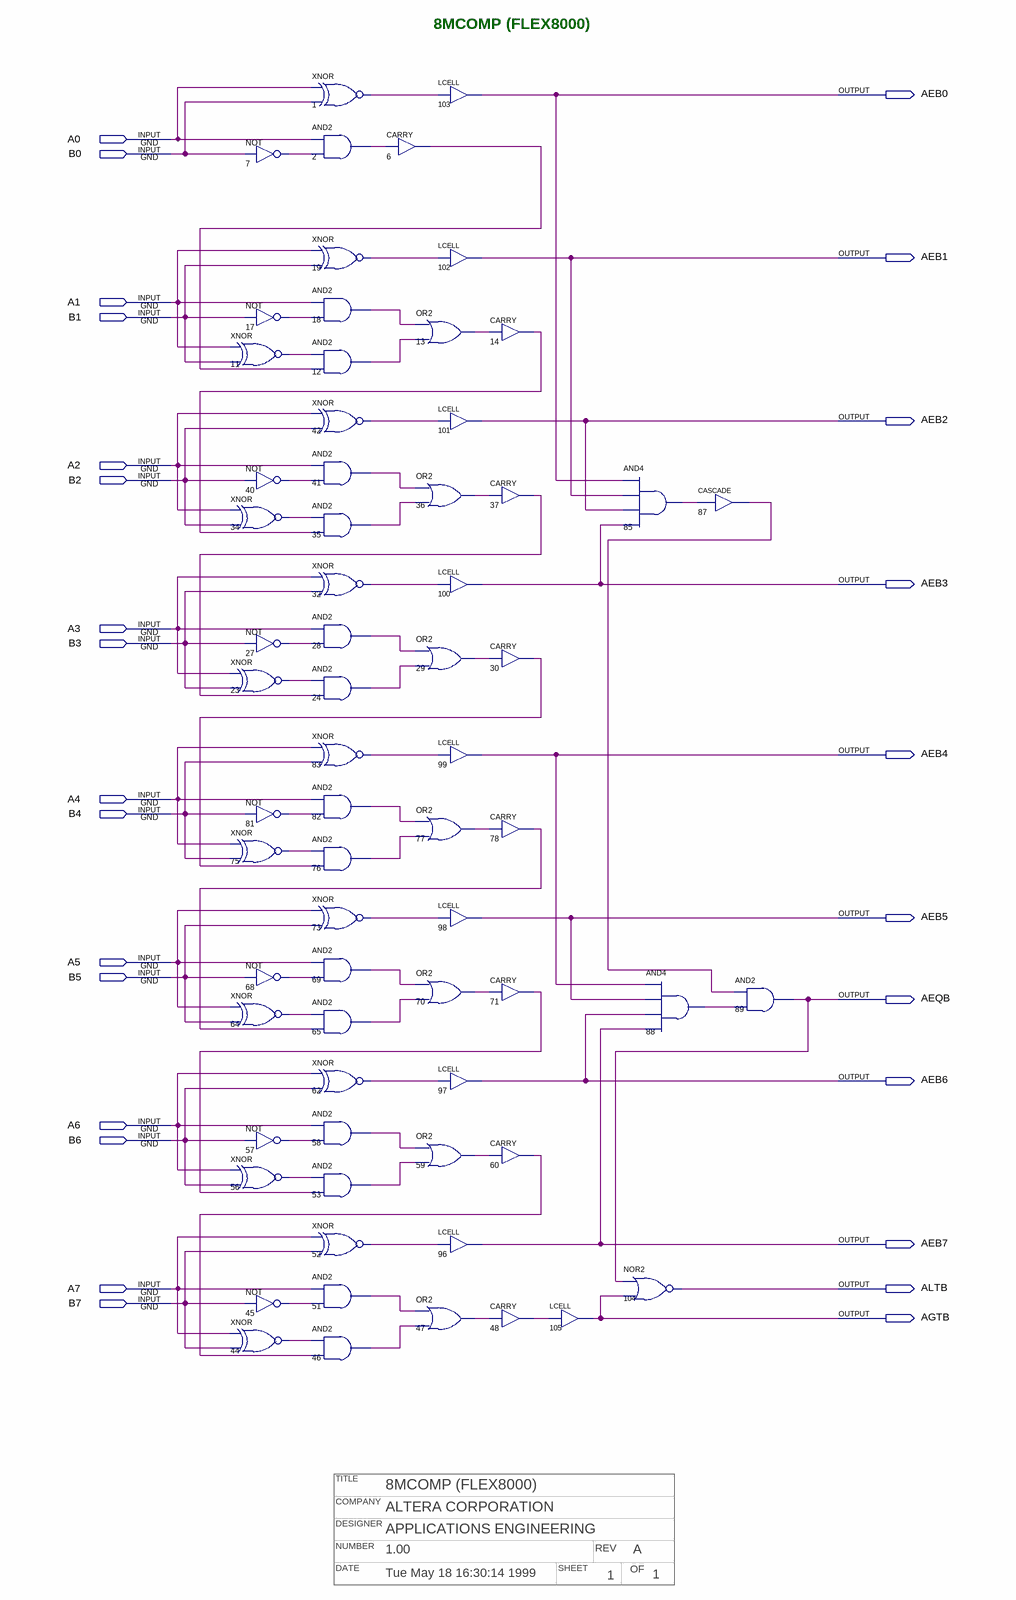
[diagram p0: schematic sheet]
// Quartus schematic f8mcomp.bdf as structural Verilog: 67 symbols, 27 pins
// Title block: TITLE: 8MCOMP (FLEX8000); COMPANY: ALTERA CORPORATION; DESIGNER: APPLICATIONS ENGINEERING; NUMBER: 1.00; REV: A; DATE: Tue May 18 16:30:14 1999; SHEET: 1; OF: 1
module f8mcomp (
  input  A0,
  input  B0,
  input  A1,
  input  B1,
  input  A2,
  input  B2,
  input  A3,
  input  B3,
  input  A4,
  input  B4,
  input  A5,
  input  B5,
  input  A6,
  input  B6,
  input  A7,
  input  B7,
  output AEB0,
  output AEB1,
  output AEB2,
  output AEB3,
  output AEB4,
  output AEB5,
  output AEQB,
  output AEB6,
  output AEB7,
  output ALTB,
  output AGTB
);

  wire n1_out, n2_out, n6_out, n7_out, n11_out, n12_out, n13_out, n14_out, n17_out, n18_out, n19_out,
       n23_out, n24_out, n27_out, n28_out, n29_out, n30_out, n32_out, n34_out, n35_out, n36_out, n37_out,
       n40_out, n41_out, n42_out, n44_out, n45_out, n46_out, n47_out, n48_out, n51_out, n52_out, n53_out,
       n56_out, n57_out, n58_out, n59_out, n60_out, n62_out, n64_out, n65_out, n68_out, n69_out, n70_out,
       n71_out, n73_out, n75_out, n76_out, n77_out, n78_out, n81_out, n82_out, n83_out, n85_out, n87_out,
       n88_out;

  not u_7 (n7_out, B0);
  not u_17 (n17_out, B1);
  xnor u_11 (n11_out, A1, B1);
  not u_40 (n40_out, B2);
  xnor u_34 (n34_out, A2, B2);
  not u_27 (n27_out, B3);
  xnor u_23 (n23_out, A3, B3);
  not u_81 (n81_out, B4);
  xnor u_75 (n75_out, A4, B4);
  not u_68 (n68_out, B5);
  xnor u_64 (n64_out, A5, B5);
  not u_57 (n57_out, B6);
  xnor u_56 (n56_out, A6, B6);
  not u_45 (n45_out, B7);
  xnor u_44 (n44_out, A7, B7);
  xnor u_1 (n1_out, A0, B0);
  and u_2 (n2_out, A0, n7_out);
  xnor u_19 (n19_out, A1, B1);
  and u_18 (n18_out, A1, n17_out);
  and u_12 (n12_out, n11_out, n6_out);
  xnor u_42 (n42_out, A2, B2);
  and u_41 (n41_out, A2, n40_out);
  and u_35 (n35_out, n34_out, n14_out);
  xnor u_32 (n32_out, A3, B3);
  and u_28 (n28_out, A3, n27_out);
  and u_24 (n24_out, n23_out, n37_out);
  xnor u_83 (n83_out, A4, B4);
  and u_82 (n82_out, A4, n81_out);
  and u_76 (n76_out, n75_out, n30_out);
  xnor u_73 (n73_out, A5, B5);
  and u_69 (n69_out, A5, n68_out);
  and u_65 (n65_out, n64_out, n78_out);
  xnor u_62 (n62_out, A6, B6);
  and u_58 (n58_out, A6, n57_out);
  and u_53 (n53_out, n56_out, n71_out);
  xnor u_52 (n52_out, A7, B7);
  and u_51 (n51_out, A7, n45_out);
  and u_46 (n46_out, n44_out, n60_out);
  CARRY u_6 (.IN(n2_out), .OUT(n6_out));
  LCELL u_103 (.IN(n1_out), .OUT(AEB0));
  LCELL u_102 (.IN(n19_out), .OUT(AEB1));
  or u_13 (n13_out, n18_out, n12_out);
  LCELL u_101 (.IN(n42_out), .OUT(AEB2));
  or u_36 (n36_out, n41_out, n35_out);
  LCELL u_100 (.IN(n32_out), .OUT(AEB3));
  or u_29 (n29_out, n28_out, n24_out);
  LCELL u_99 (.IN(n83_out), .OUT(AEB4));
  or u_77 (n77_out, n82_out, n76_out);
  LCELL u_98 (.IN(n73_out), .OUT(AEB5));
  or u_70 (n70_out, n69_out, n65_out);
  LCELL u_97 (.IN(n62_out), .OUT(AEB6));
  or u_59 (n59_out, n58_out, n53_out);
  LCELL u_96 (.IN(n52_out), .OUT(AEB7));
  or u_47 (n47_out, n51_out, n46_out);
  CARRY u_14 (.IN(n13_out), .OUT(n14_out));
  CARRY u_37 (.IN(n36_out), .OUT(n37_out));
  CARRY u_30 (.IN(n29_out), .OUT(n30_out));
  CARRY u_78 (.IN(n77_out), .OUT(n78_out));
  CARRY u_71 (.IN(n70_out), .OUT(n71_out));
  CARRY u_60 (.IN(n59_out), .OUT(n60_out));
  CARRY u_48 (.IN(n47_out), .OUT(n48_out));
  LCELL u_105 (.IN(n48_out), .OUT(AGTB));
  and u_85 (n85_out, AEB0, AEB1, AEB2, AEB3);
  nor u_104 (ALTB, AEQB, AGTB);
  CASCADE u_87 (.IN(n85_out), .OUT(n87_out));
  and u_88 (n88_out, AEB4, AEB5, AEB6, AEB7);
  and u_89 (AEQB, n87_out, n88_out);

  // Notes on the sheet:
  //   8MCOMP (FLEX8000)
endmodule
